# EAGLE schematic Bolt (EAGLE 9.6.2)

## Sheet 1 of 5: Power supply
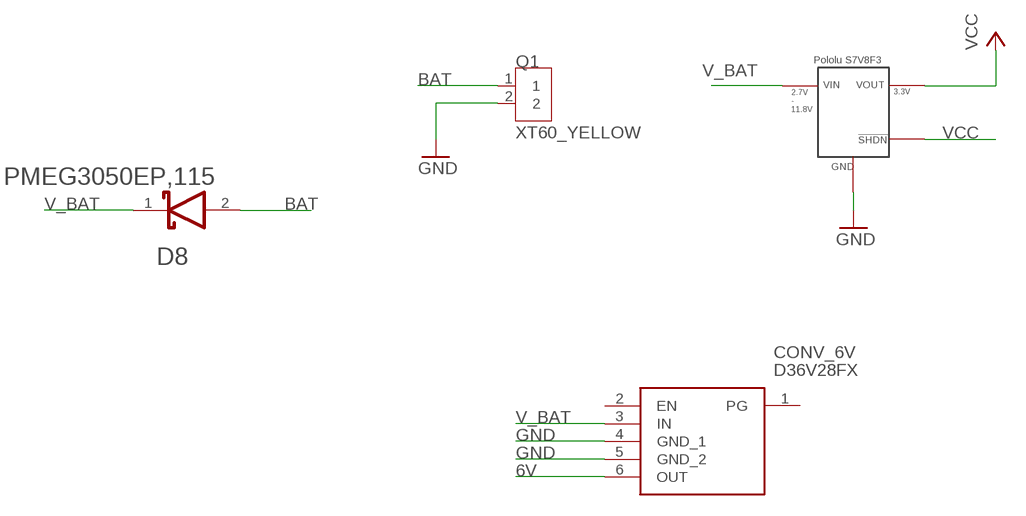
[diagram p0: schematic, sheet 1]

### Parts
CONV_3V3  S7V8F3  [S7V8F3]
CONV_6V  D36V28FX  [D36V28FX]
D8  NEXPERIA_PMEG3050EP,115NEXPERIA_PMEG3050EP,115_0_0  [NEXPERIA_PMEG3050EP,115_0]
Q1  XT60_YELLOW  [AMASS_XT60PB-M]

### Nets
6V: CONV_6V.6(OUT) ; also sheet 3
BAT: D8.2(ANODE) Q1.1
GND: CONV_3V3.GND CONV_6V.4(GND_1) CONV_6V.5(GND_2) Q1.2 ; also sheet 2,3,4,5
V_BAT: CONV_3V3.VIN CONV_6V.3(IN) D8.1(CATHODE)
VCC: CONV_3V3.!SHDN CONV_3V3.VOUT ; also sheet 2,3,4,5
Unconnected: CONV_6V.1(PG) CONV_6V.2(EN)

## Sheet 2 of 5: MCU
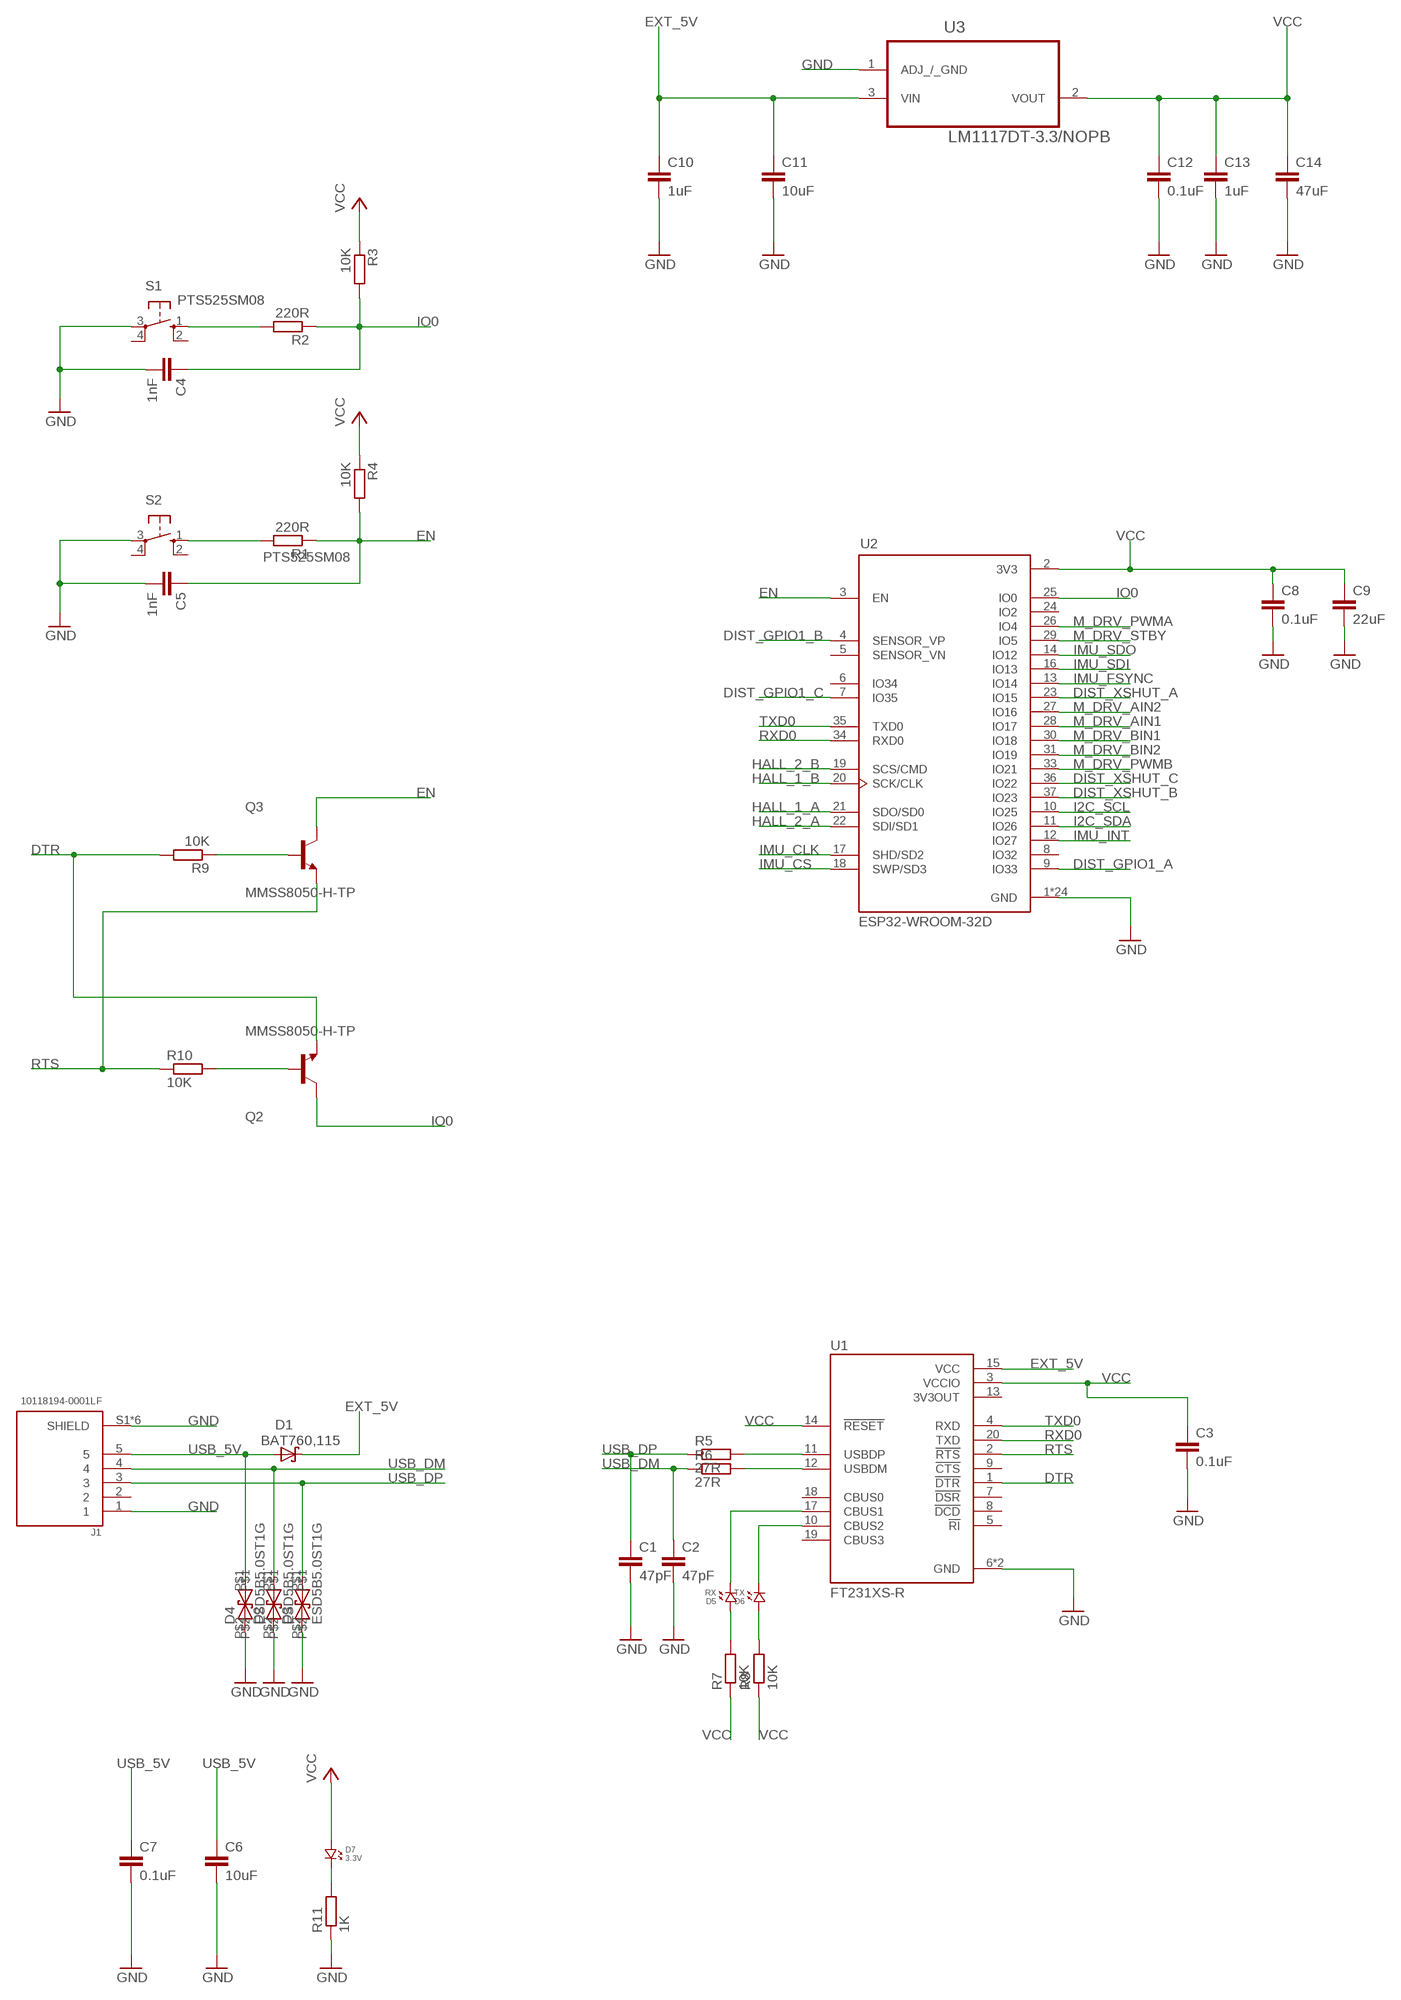
[diagram p1: schematic, sheet 2]

### Parts
C1  47pF  C-EUC0805K  [C0805K]
C2  47pF  C-EUC0805K  [C0805K]
C3  0.1uF  C-EUC0805K  [C0805K]
C4  1nF  C-EUC0805K  [C0805K]
C5  1nF  C-EUC0805K  [C0805K]
C6  10uF  C-EUC0805K  [C0805K]
C7  0.1uF  C-EUC0805K  [C0805K]
C8  0.1uF  C-EUC0805K  [C0805K]
C9  22uF  C-EUC0805K  [C0805K]
C10  1uF  C-EUC0805K  [C0805K]
C11  10uF  C-EUC0805K  [C0805K]
C12  0.1uF  C-EUC0805K  [C0805K]
C13  1uF  C-EUC0805K  [C0805K]
C14  47uF  C-EUC0805K  [C0805K]
D1  BAT760,115  [SOD323(F)]
D2  ESD5B5.0ST1G  [SOD-523]
D3  ESD5B5.0ST1G  [SOD-523]
D4  ESD5B5.0ST1G  [SOD-523]
D5  RX  LED.0805  [0805.LED]
D6  TX  LED.0805  [0805.LED]
D7  3.3V  LED.0805  [0805.LED]
J1  10118194-0001LF  [AMPHENOL_10118194-0001LF]
Q2  MMSS8050-H-TP  [TRANS_MMSS8050-H-TP]
Q3  MMSS8050-H-TP  [TRANS_MMSS8050-H-TP]
R1  220R  R-EU_R0805  [R0805]
R2  220R  R-EU_R0805  [R0805]
R3  10K  R-EU_R0805  [R0805]
R4  10K  R-EU_R0805  [R0805]
R5  27R  R-EU_R0805  [R0805]
R6  27R  R-EU_R0805  [R0805]
R7  10K  R-EU_R0805  [R0805]
R8  10K  R-EU_R0805  [R0805]
R9  10K  R-EU_R0805  [R0805]
R10  10K  R-EU_R0805  [R0805]
R11  1K  R-EU_R0805  [R0805]
S1  PTS525SM08  [SM08]
S2  PTS525SM08  [SM08]
U1  FT231XS-R  [SOP63P599X175-20N]
U2  ESP32-WROOM-32D  [MODULE_ESP32-WROOM-32D]
U3  LM1117DT-3.3/NOPB  [TO228P970X238-3N]

### Nets
DIST_GPIO1_A: U2.9(IO33) ; also sheet 5
DIST_GPIO1_B: U2.4(SENSOR_VP) ; also sheet 5
DIST_GPIO1_C: U2.7(IO35) ; also sheet 5
DIST_XSHUT_A: U2.23(IO15) ; also sheet 5
DIST_XSHUT_B: U2.37(IO23) ; also sheet 5
DIST_XSHUT_C: U2.36(IO22) ; also sheet 5
DTR: Q2.2(E) R9.2 U1.1(!DTR)
EN: C5.1 Q3.3(C) R1.1 R4.2 U2.3(EN)
EXT_5V: C10.1 C11.1 D1.1(K) U1.15(VCC) U3.3(VIN)
GND: C1.2 C2.2 C3.2 C4.2 C5.2 C6.2 C7.2 C8.2 C9.2 C10.2 C11.2 C12.2 C13.2 C14.2 D2.P$2 D3.P$2 D4.P$2 J1.1 J1.S1(SHIELD) J1.S2(SHIELD) J1.S3(SHIELD) J1.S4(SHIELD) J1.S5(SHIELD) J1.S6(SHIELD) R11.1 S1.3(P) S2.3(P) U1.6(GND) U1.16(GND) U2.1(GND) U2.15(GND) U2.38(GND) U2.39_1(GND) U2.39_2(GND) U2.39_3(GND) U2.39_4(GND) U2.39_5(GND) U2.39_6(GND) U2.39_7(GND) U2.39_8(GND) U2.39_9(GND) U2.39_10(GND) U2.39_11(GND) U2.39_12(GND) U2.39_13(GND) U2.39_14(GND) U2.39_15(GND) U2.39_16(GND) U2.39_17(GND) U2.39_18(GND) U2.39_19(GND) U2.39_20(GND) U2.39_21(GND) U3.1(ADJ_/_GND) ; also sheet 1,3,4,5
HALL_1_A: U2.21(SDO/SD0) ; also sheet 5
HALL_1_B: U2.20(SCK/CLK) ; also sheet 5
HALL_2_A: U2.22(SDI/SD1) ; also sheet 5
HALL_2_B: U2.19(SCS/CMD) ; also sheet 5
I2C_SCL: U2.10(IO25) ; also sheet 5
I2C_SDA: U2.11(IO26) ; also sheet 5
IMU_CLK: U2.17(SHD/SD2) ; also sheet 4
IMU_CS: U2.18(SWP/SD3) ; also sheet 4
IMU_FSYNC: U2.13(IO14) ; also sheet 4
IMU_INT: U2.12(IO27) ; also sheet 4
IMU_SDI: U2.16(IO13) ; also sheet 4
IMU_SDO: U2.14(IO12) ; also sheet 4
IO0: C4.1 Q2.3(C) R2.1 R3.2 U2.25(IO0)
M_DRV_AIN1: U2.28(IO17) ; also sheet 3
M_DRV_AIN2: U2.27(IO16) ; also sheet 3
M_DRV_BIN1: U2.30(IO18) ; also sheet 3
M_DRV_BIN2: U2.31(IO19) ; also sheet 3
M_DRV_PWMA: U2.26(IO4) ; also sheet 3
M_DRV_PWMB: U2.33(IO21) ; also sheet 3
M_DRV_STBY: U2.29(IO5) ; also sheet 3
N$1: Q2.1(B) R10.2
N$28: D7.P$2 R11.2
N$35: D5.P$1 R7.2
N$55: R5.2 U1.11(USBDP)
N$56: R6.2 U1.12(USBDM)
N$61: R2.2 S1.1(S)
N$62: R1.2 S2.1(S)
N$124: Q3.1(B) R9.1
N$126: D5.P$2 U1.17(CBUS1)
N$127: D6.P$2 U1.10(CBUS2)
N$129: D6.P$1 R8.2
RTS: Q3.2(E) R10.1 U1.2(!RTS)
RXD0: U1.20(TXD) U2.34(RXD0)
TXD0: U1.4(RXD) U2.35(TXD0)
USB_5V: C6.1 C7.1 D1.2(A) D4.P$1 J1.5
USB_DM: C2.1 D2.P$1 J1.4 R6.1
USB_DP: C1.1 D3.P$1 J1.3 R5.1
VCC: C3.1 C8.1 C9.1 C12.1 C13.1 C14.1 D7.P$1 R3.1 R4.1 R7.1 R8.1 U1.3(VCCIO) U1.14(!RESET) U2.2(3V3) U3.2(VOUT) ; also sheet 1,3,4,5
Unconnected: J1.2 S1.2(S) S1.4(P) S2.2(S) S2.4(P) U1.5(!RI) U1.7(!DSR) U1.8(!DCD) U1.9(!CTS) U1.18(CBUS0) U1.19(CBUS3) U2.5(SENSOR_VN) U2.6(IO34) U2.8(IO32) U2.24(IO2)

## Sheet 3 of 5: Motors driver
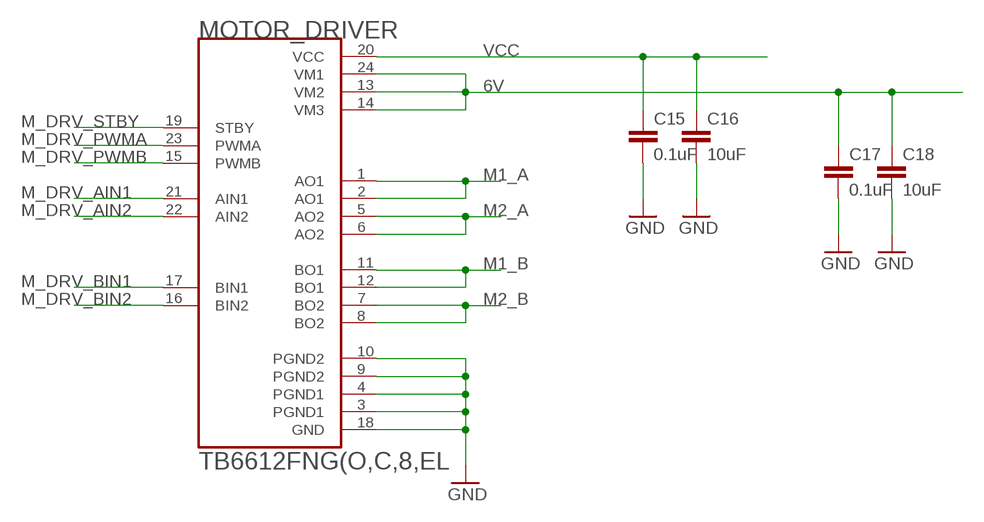
[diagram p2: schematic, sheet 3]

### Parts
C15  0.1uF  C-EUC0805K  [C0805K]
C16  10uF  C-EUC0805K  [C0805K]
C17  0.1uF  C-EUC0805K  [C0805K]
C18  10uF  C-EUC0805K  [C0805K]
MOTOR_DRIVER  TB6612FNG(O,C,8,EL  [SOP65P760X160-24N]

### Nets
6V: C17.1 C18.1 MOTOR_DRIVER.13(VM2) MOTOR_DRIVER.14(VM3) MOTOR_DRIVER.24(VM1) ; also sheet 1
GND: C15.2 C16.2 C17.2 C18.2 MOTOR_DRIVER.3(PGND1) MOTOR_DRIVER.4(PGND1) MOTOR_DRIVER.9(PGND2) MOTOR_DRIVER.10(PGND2) MOTOR_DRIVER.18(GND) ; also sheet 1,2,4,5
M1_A: MOTOR_DRIVER.1(AO1) MOTOR_DRIVER.2(AO1) ; also sheet 5
M1_B: MOTOR_DRIVER.11(BO1) MOTOR_DRIVER.12(BO1) ; also sheet 5
M2_A: MOTOR_DRIVER.5(AO2) MOTOR_DRIVER.6(AO2) ; also sheet 5
M2_B: MOTOR_DRIVER.7(BO2) MOTOR_DRIVER.8(BO2) ; also sheet 5
M_DRV_AIN1: MOTOR_DRIVER.21(AIN1) ; also sheet 2
M_DRV_AIN2: MOTOR_DRIVER.22(AIN2) ; also sheet 2
M_DRV_BIN1: MOTOR_DRIVER.17(BIN1) ; also sheet 2
M_DRV_BIN2: MOTOR_DRIVER.16(BIN2) ; also sheet 2
M_DRV_PWMA: MOTOR_DRIVER.23(PWMA) ; also sheet 2
M_DRV_PWMB: MOTOR_DRIVER.15(PWMB) ; also sheet 2
M_DRV_STBY: MOTOR_DRIVER.19(STBY) ; also sheet 2
VCC: C15.1 C16.1 MOTOR_DRIVER.20(VCC) ; also sheet 1,2,4,5

## Sheet 4 of 5: IMU
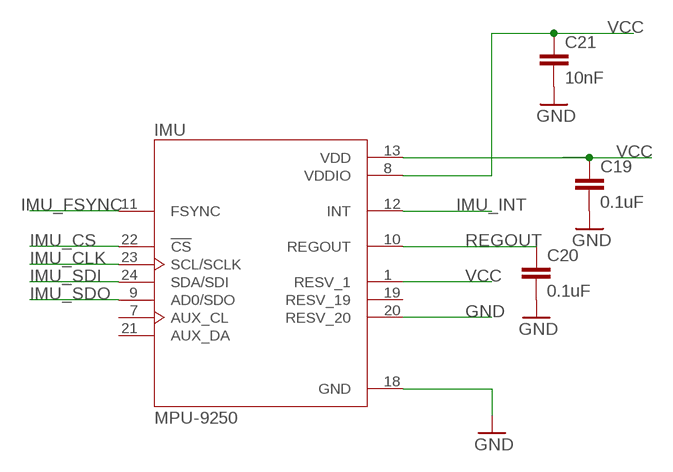
[diagram p3: schematic, sheet 4]

### Parts
C19  0.1uF  C-EUC0805K  [C0805K]
C20  0.1uF  C-EUC0805K  [C0805K]
C21  10nF  C-EUC0805K  [C0805K]
IMU  MPU-9250  [QFN40P300X300X105-24N]

### Nets
GND: C19.2 C20.2 C21.2 IMU.18(GND) IMU.20(RESV_20) ; also sheet 1,2,3,5
IMU_CLK: IMU.23(SCL/SCLK) ; also sheet 2
IMU_CS: IMU.22(!CS) ; also sheet 2
IMU_FSYNC: IMU.11(FSYNC) ; also sheet 2
IMU_INT: IMU.12(INT) ; also sheet 2
IMU_SDI: IMU.24(SDA/SDI) ; also sheet 2
IMU_SDO: IMU.9(AD0/SDO) ; also sheet 2
REGOUT: C20.1 IMU.10(REGOUT)
VCC: C19.1 C21.1 IMU.1(RESV_1) IMU.8(VDDIO) IMU.13(VDD) ; also sheet 1,2,3,5
Unconnected: IMU.7(AUX_CL) IMU.19(RESV_19) IMU.21(AUX_DA)

## Sheet 5 of 5: External pins
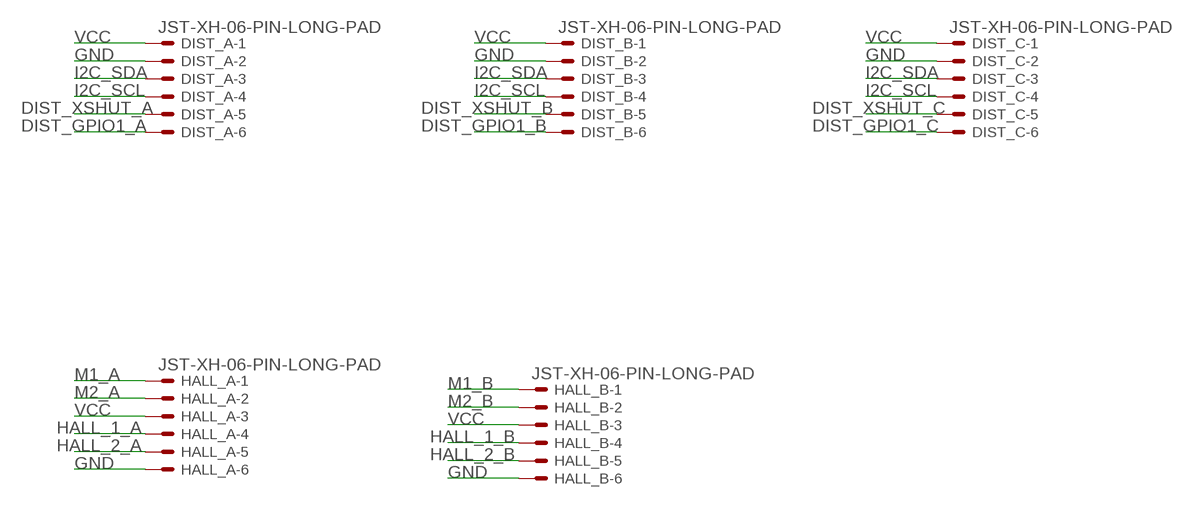
[diagram p4: schematic, sheet 5]

### Parts
DIST_A  JST-XH-06-PIN-LONG-PAD  [JST-XH-06-PACKAGE-LONG-PAD]
DIST_B  JST-XH-06-PIN-LONG-PAD  [JST-XH-06-PACKAGE-LONG-PAD]
DIST_C  JST-XH-06-PIN-LONG-PAD  [JST-XH-06-PACKAGE-LONG-PAD]
HALL_A  JST-XH-06-PIN-LONG-PAD  [JST-XH-06-PACKAGE-LONG-PAD]
HALL_B  JST-XH-06-PIN-LONG-PAD  [JST-XH-06-PACKAGE-LONG-PAD]

### Nets
DIST_GPIO1_A: DIST_A.6 ; also sheet 2
DIST_GPIO1_B: DIST_B.6 ; also sheet 2
DIST_GPIO1_C: DIST_C.6 ; also sheet 2
DIST_XSHUT_A: DIST_A.5 ; also sheet 2
DIST_XSHUT_B: DIST_B.5 ; also sheet 2
DIST_XSHUT_C: DIST_C.5 ; also sheet 2
GND: DIST_A.2 DIST_B.2 DIST_C.2 HALL_A.6 HALL_B.6 ; also sheet 1,2,3,4
HALL_1_A: HALL_A.4 ; also sheet 2
HALL_1_B: HALL_B.4 ; also sheet 2
HALL_2_A: HALL_A.5 ; also sheet 2
HALL_2_B: HALL_B.5 ; also sheet 2
I2C_SCL: DIST_A.4 DIST_B.4 DIST_C.4 ; also sheet 2
I2C_SDA: DIST_A.3 DIST_B.3 DIST_C.3 ; also sheet 2
M1_A: HALL_A.1 ; also sheet 3
M1_B: HALL_B.1 ; also sheet 3
M2_A: HALL_A.2 ; also sheet 3
M2_B: HALL_B.2 ; also sheet 3
VCC: DIST_A.1 DIST_B.1 DIST_C.1 HALL_A.3 HALL_B.3 ; also sheet 1,2,3,4

## Power pins joined to a net without a drawn wire
3V3OUT: U1.13(3V3OUT)

## Library data of the parts
C1-C21 = rcl:C-EU: CAPACITOR, European symbol; SPICEPREFIX: C
CONV_3V3 = Pololu_S7V8F3:S7V8F3: Pololu S7V8F3 - Pololu 3.3V Step-Up/Step-Down Voltage Regulator S7V8F3 - The S7V8F3 switching step-up/step-down regulator efficiently produces a fixed 3.3 V output from input voltages between 2.7 V and 11.8 V. Its ability to convert both higher and lower input voltages makes it useful for applications where the power supply voltage can vary greatly, as with batteries that start above but discharge below the regulated voltage. The compact module has a typical efficiency of over 90% and can deliver 500 mA to 1 A across most of the input voltage range.
CONV_6V = D36V28FX:D36V28FX: 5V, 3.2A Step-Down Voltage Regulator D36V28F5 Source: Datasheet <https://www.pololu.com/product/3782>; DESCRIPTION: 5V, 3.2A Step-Down Voltage Regulator D36V28F5; HEIGHT: 8.77mm; MANUFACTURER_NAME: POLOLU ROBOTICS & ELECTRONICS; MANUFACTURER_PART_NUMBER: D36V28FX
D1 = BAT760_115:BAT760,115: Medium power Schottky barrier single diode Planar medium power Schottky barrier single diode with an integrated guard ring for stress protection, encapsulated in a SOD323 (SC-76) very small Surface-Mounted Device SMD plastic package. AAL Eindhoven MK Check prices <https://pricing.snapeda.com/parts/BAT760%2C115/Nexperia%20USA/view-part?ref=eda>; AVAILABILITY: Good; DESCRIPTION: Diode Schottky 20V 1A (DC) Surface Mount SOD-323; MF: Nexperia USA; MP: BAT760,115; PACKAGE: SOD323-2 Nexperia USA Inc.; PRICE: None; PURCHASE-URL: https://pricing.snapeda.com/search/part/BAT760,115/?ref=eda
D2-D4 = ESD5B5.0ST1G:ESD5B5.0ST1G: Medium power Schottky barrier single diode Planar medium power Schottky barrier single diode with an integrated guard ring for stress protection, encapsulated in a SOD323 (SC-76) very small Surface-Mounted Device SMD plastic package. AAL Eindhoven MK Check prices <https://pricing.snapeda.com/parts/BAT760%2C115/Nexperia%20USA/view-part?ref=eda>; AVAILABILITY: Good; DESCRIPTION: Diode Schottky 20V 1A (DC) Surface Mount SOD-323; MF: Nexperia USA; MP: BAT760,115; PACKAGE: SOD323-2 Nexperia USA Inc.; PRICE: None; PURCHASE-URL: https://pricing.snapeda.com/search/part/BAT760,115/?ref=eda
D5-D7 = leds:LED
D8 = Nexperia - PMEG3050EP,115:NEXPERIA_PMEG3050EP,115: 5 A low VF MEGA Schottky barrier rectifier; AMBIENT_TEMPERATURE_RANGE_HIGH: +150°C; AMBIENT_TEMPERATURE_RANGE_LOW: -55°C; CENTROID_NOT_SPECIFIED: No; DATASHEET: https://assets.nexperia.com/documents/data-sheet/PMEG3050EP.pdf; DEVICE_CLASS_L1: Discrete Semiconductors; DEVICE_CLASS_L2: Diodes; DEVICE_CLASS_L3: Schottky Diodes; DIGIKEY_DESCRIPTION: DIODE SCHOTTKY 30V 5A SOD128; DIGIKEY_PART_NUMBER: 1727-5317-1-ND; FORWARD_CURRENT: 5A; HEIGHT: 1.1mm; LEAD_FREE: yes; MAX_JUNCTION_TEMP: +150°C; MAX_SURGE_FORWARD_CURRENT: 70A; MF: Nexperia; MFG_PACKAGE_IDENT: SOD128; MFG_PACKAGE_IDENT_DATE: 06/2017; MFG_PACKAGE_IDENT_REV: 0; MOUSER_PART_NUMBER: 771-PMEG3050EP115; MPN: PMEG3050EP,115; PACKAGE: CFP5; PEAK_REVERSE_CURRENT: 8mA; PREFIX: D; REVERSE_VOLTAGE: 30V; ROHS: yes; VERIFICATION_VERSION: 0.0.0.1
DIST_A DIST_B DIST_C HALL_A HALL_B = Rembrandt Electronics - JST XH Connectors v1-0:JST-XH-06-PIN: JST XH Connector 2 Pin Wire to board connector. Pitch: 2,54 mm, (0.100") Number of pins: 6 Created by Rembrandt Electronics www.rembrandtelectronics.com
IMU = MPU-9250:MPU-9250: Axis=3 Axis Gyro+3 Axis Accel+Compass. Pin For Pin With m Check prices <https://pricing.snapeda.com/parts/MPU-9250/TDK%20InvenSense/view-part?ref=eda>; AVAILABILITY: Bad; DESCRIPTION: Accelerometer, Gyroscope, Magnetometer, 9 Axis Sensor I²C, SPI Output; MF: TDK InvenSense; MP: MPU-9250; PACKAGE: TFQFN-24 TDK InvenSense; PRICE: None
J1 = 10118194-0001LF:10118194-0001LF: Micro Usb, 2.0 Type b, Rcpt, Smt Check prices <https://pricing.snapeda.com/parts/10118194-0001LF/Amphenol%20ICC%20%28FCI%29/view-part?ref=eda>; AVAILABILITY: Good; DESCRIPTION: USB - micro B USB 2.0 Receptacle Connector 5 Position Surface Mount, Right Angle; Through Hole; MF: Amphenol ICC (FCI); MP: 10118194-0001LF; PACKAGE: None; PRICE: None; PURCHASE-URL: https://pricing.snapeda.com/search/part/10118194-0001LF/?ref=eda
MOTOR_DRIVER = TB6612FNG_O_C_8_EL:TB6612FNG(O,C,8,EL: Stepping Motor Driver Ic Unipolor Copper Wire 8" Check prices <https://pricing.snapeda.com/parts/TB6612FNG%28O%2CC%2C8%2CEL/Toshiba/view-part?ref=eda>; AVAILABILITY: Good; DESCRIPTION: Motor Driver Power MOSFET Parallel 24-SSOP; MF: Toshiba; MP: TB6612FNG(O,C,8,EL; PACKAGE: SSOP-24 Toshiba; PRICE: None
Q1 = XT60_YELLOW:XT60_YELLOW: Connector 2 pins; AVAILABILITY: Unavailable; DESCRIPTION: Power connector; 65A; PIN: 2; Colour: yellow; MF: Pololu; MP: XT60 YELLOW; PACKAGE: None; PRICE: None
Q2 Q3 = MMSS8050-H-TP:MMSS8050-H-TP: MMSS8050-H Series 25 V 1.5 A NPN Silicon Plastic-Encapsulate Transistor-SOT-23 Check prices <https://pricing.snapeda.com/parts/MMSS8050-H-TP/Micro%20Commercial/view-part?ref=eda>; AVAILABILITY: Good; DESCRIPTION: Bipolar (BJT) Transistor NPN 25V 1.5A 100MHz 625mW Surface Mount SOT-23; MF: Micro Commercial; MP: MMSS8050-H-TP; PACKAGE: SOT-23 MCC; PRICE: None; PURCHASE-URL: https://pricing.snapeda.com/search/part/MMSS8050-H-TP/?ref=eda
R1-R11 = rcl:R-EU_: RESISTOR, European symbol; SPICEPREFIX: R
S1 S2 = pts525_20:PTS525*: PTS 525 Series Miniature Tact Switch for SMD Source: http://www.ck-components.com/14407/pts525_8sept14.pdf/; MF: C&K Components; MPN: PTS525SM08SMTR2LFS; OC_FARNELL: unknown; OC_NEWARK: unknown
U1 = FT231XS-R:FT231XS-R: USB Full Speed to Full Handshake UART with USB Charger Detection; DESCRIPTION: USB Bridge, USB to UART USB 2.0 UART Interface 20-SSOP; DIGI-KEY_PART_NUMBER: 768-1129-1-ND; MF: FTDI,; MP: FT231XS-R; PACKAGE: SSOP-20 FTDI; PURCHASE-URL: https://pricing.snapeda.com/search/part/FT231XS-R/?ref=eda
U2 = ESP32-WROOM-32D:ESP32-WROOM-32D: Bluetooth, WiFi 802.11b/g/n, Bluetooth v4.2 + EDR, Class 1, 2 and 3 Transceiver Module 2.4GHz ~ 2.5GHz Integrated, Trace Surface Mount Check prices <https://pricing.snapeda.com/parts/ESP32-WROOM-32D/Espressif%20Systems/view-part?ref=eda>; AVAILABILITY: Bad; DESCRIPTION: Bluetooth, WiFi 802.11b/g/n, Bluetooth v4.2 +EDR, Class 1, 2 and 3 Transceiver Module 2.4GHz ~ 2.5GHz Integrated, Trace Surface Mount; MF: Espressif Systems; MP: ESP32-WROOM-32D; PACKAGE: Module Espressif Systems; PRICE: None
U3 = LM1117DT-3.3_NOPB:LM1117DT-3.3/NOPB: IC, LDO VOLT REG, 3.3V, 0.8A Check prices <https://pricing.snapeda.com/parts/LM1117DT-3.3/NOPB/Texas%20Instruments/view-part?ref=eda>; AVAILABILITY: Good; DESCRIPTION: 800-mA 15-V linear voltage regulator 3-TO-252 0 to 125; MF: Texas Instruments; MP: LM1117DT-3.3/NOPB; PACKAGE: TO-252-3 Texas Instruments; PRICE: None; PURCHASE-URL: https://pricing.snapeda.com/search/part/LM1117DT-3.3/NOPB/?ref=eda